# Altium project DC309A.PrjPcb (part 4 of 7)

## Sheet DC309A_FTDI.SchDoc: FTDI
size 558 x 431 mm; Date: Not shown in title block; ApprovedBy: Not shown in title block; CheckedBy: Not shown in title block; Author: Not shown in title block; CompanyName: Not shown in title block; DrawnBy: KAVIKANNAN; Engineer: Not shown in title block; Organization: Not shown in title block; Address1: Not shown in title block; Address2: Not shown in title block; Address3: Not shown in title block; Address4: Not shown in title block; DocumentNumber: 6; Revision: Use project parameter SCH_Rev; SheetNumber: 6; SheetTotal: 11; PageSetup: Record=PageOptions|CenterHorizontal=True|CenterVertical=True|PrintScale=1.00|XCorrection=1.00|YCorrection=1.00|PrintKind=0|BorderSize=5000000|LeftOffset=0|BottomOffset=0|Orientation=2|PaperLength=1000|PaperWidth=1000|Scale=100|PaperSource=15|PrintQuality=600|MediaType=1|DitherType=10|PaperKind=Letter|PrintScaleMode=1; CurrentTime: Not shown in title block; CurrentDate: Not shown in title block; Time: Not shown in title block; DocumentFullPathAndName: Not shown in title block; DocumentName: Not shown in title block; ModifiedDate: Not shown in title block; ImagePath: Not shown in title block
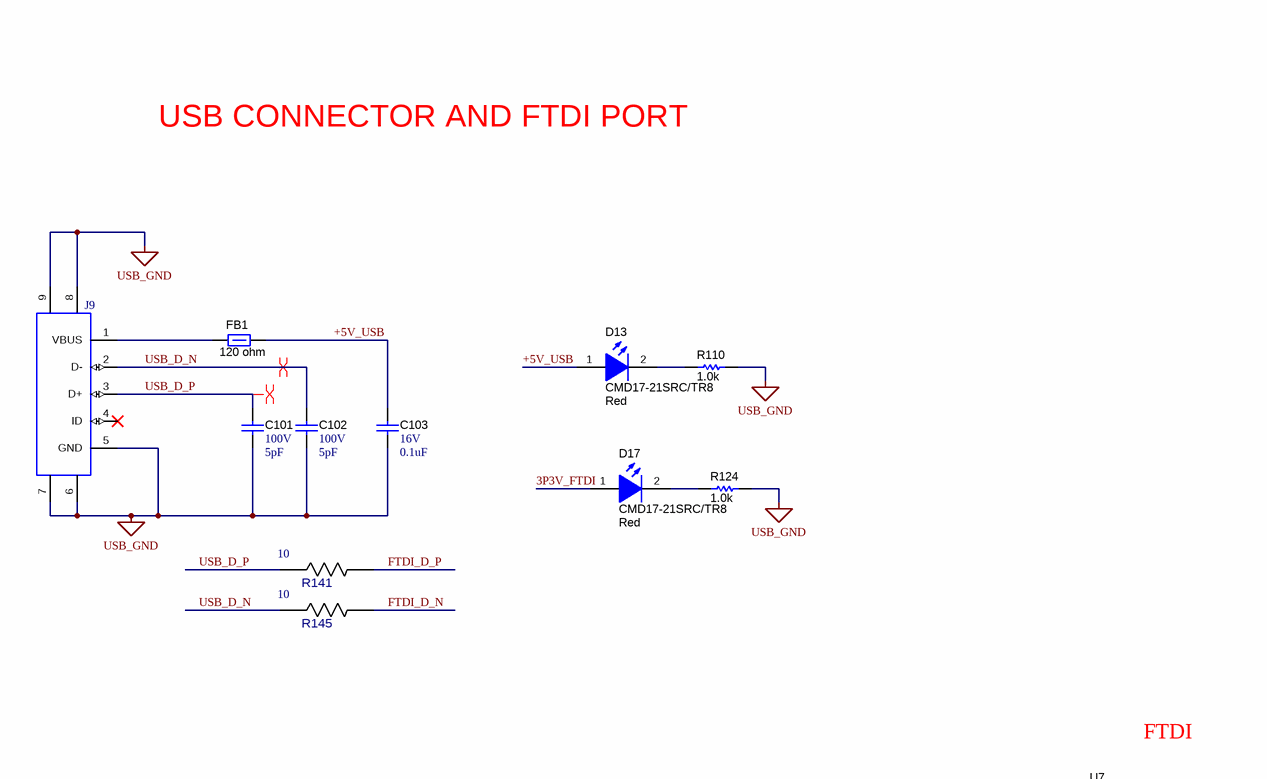
[diagram p16: DC309A_FTDI.SchDoc, top left]
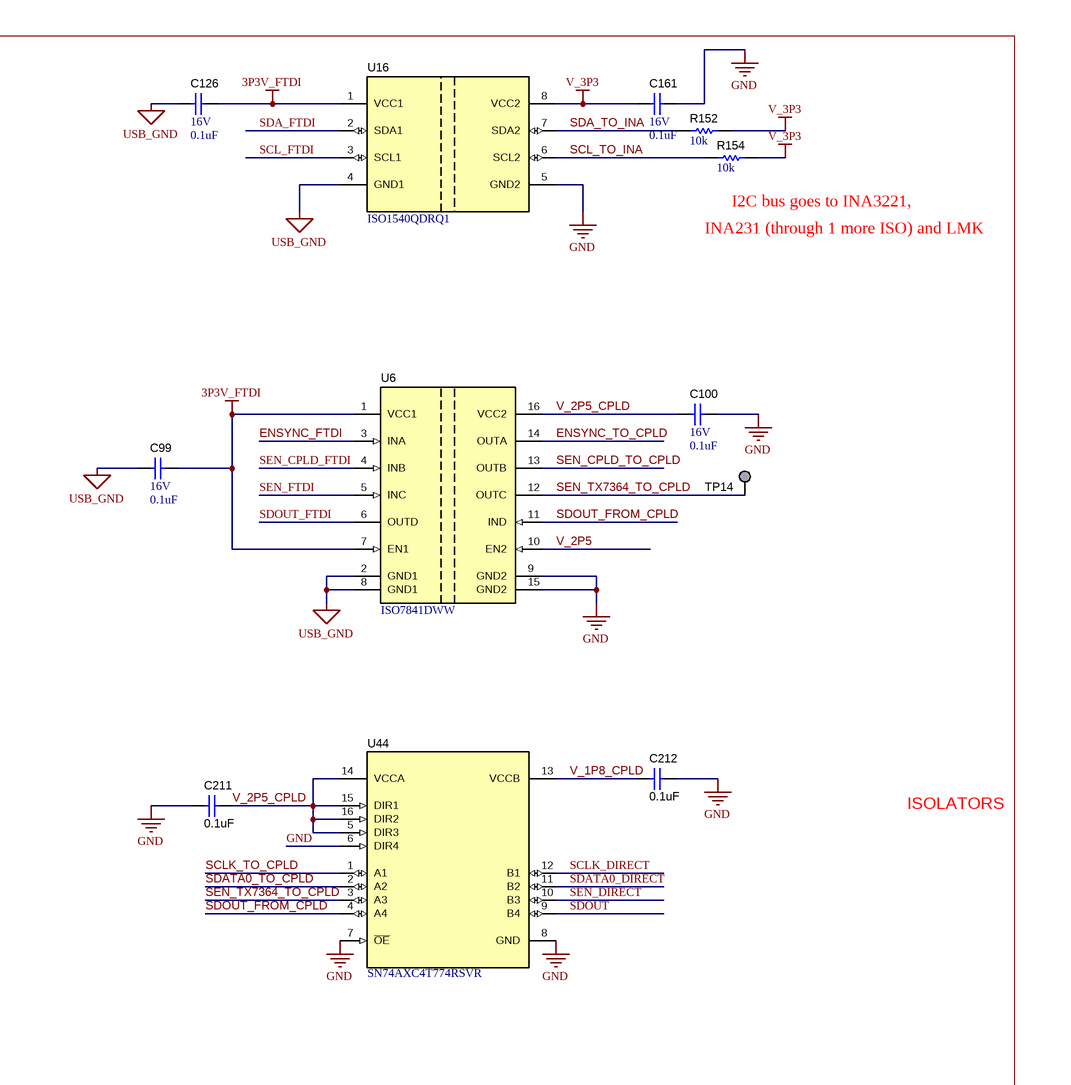
[diagram p17: DC309A_FTDI.SchDoc, top right]
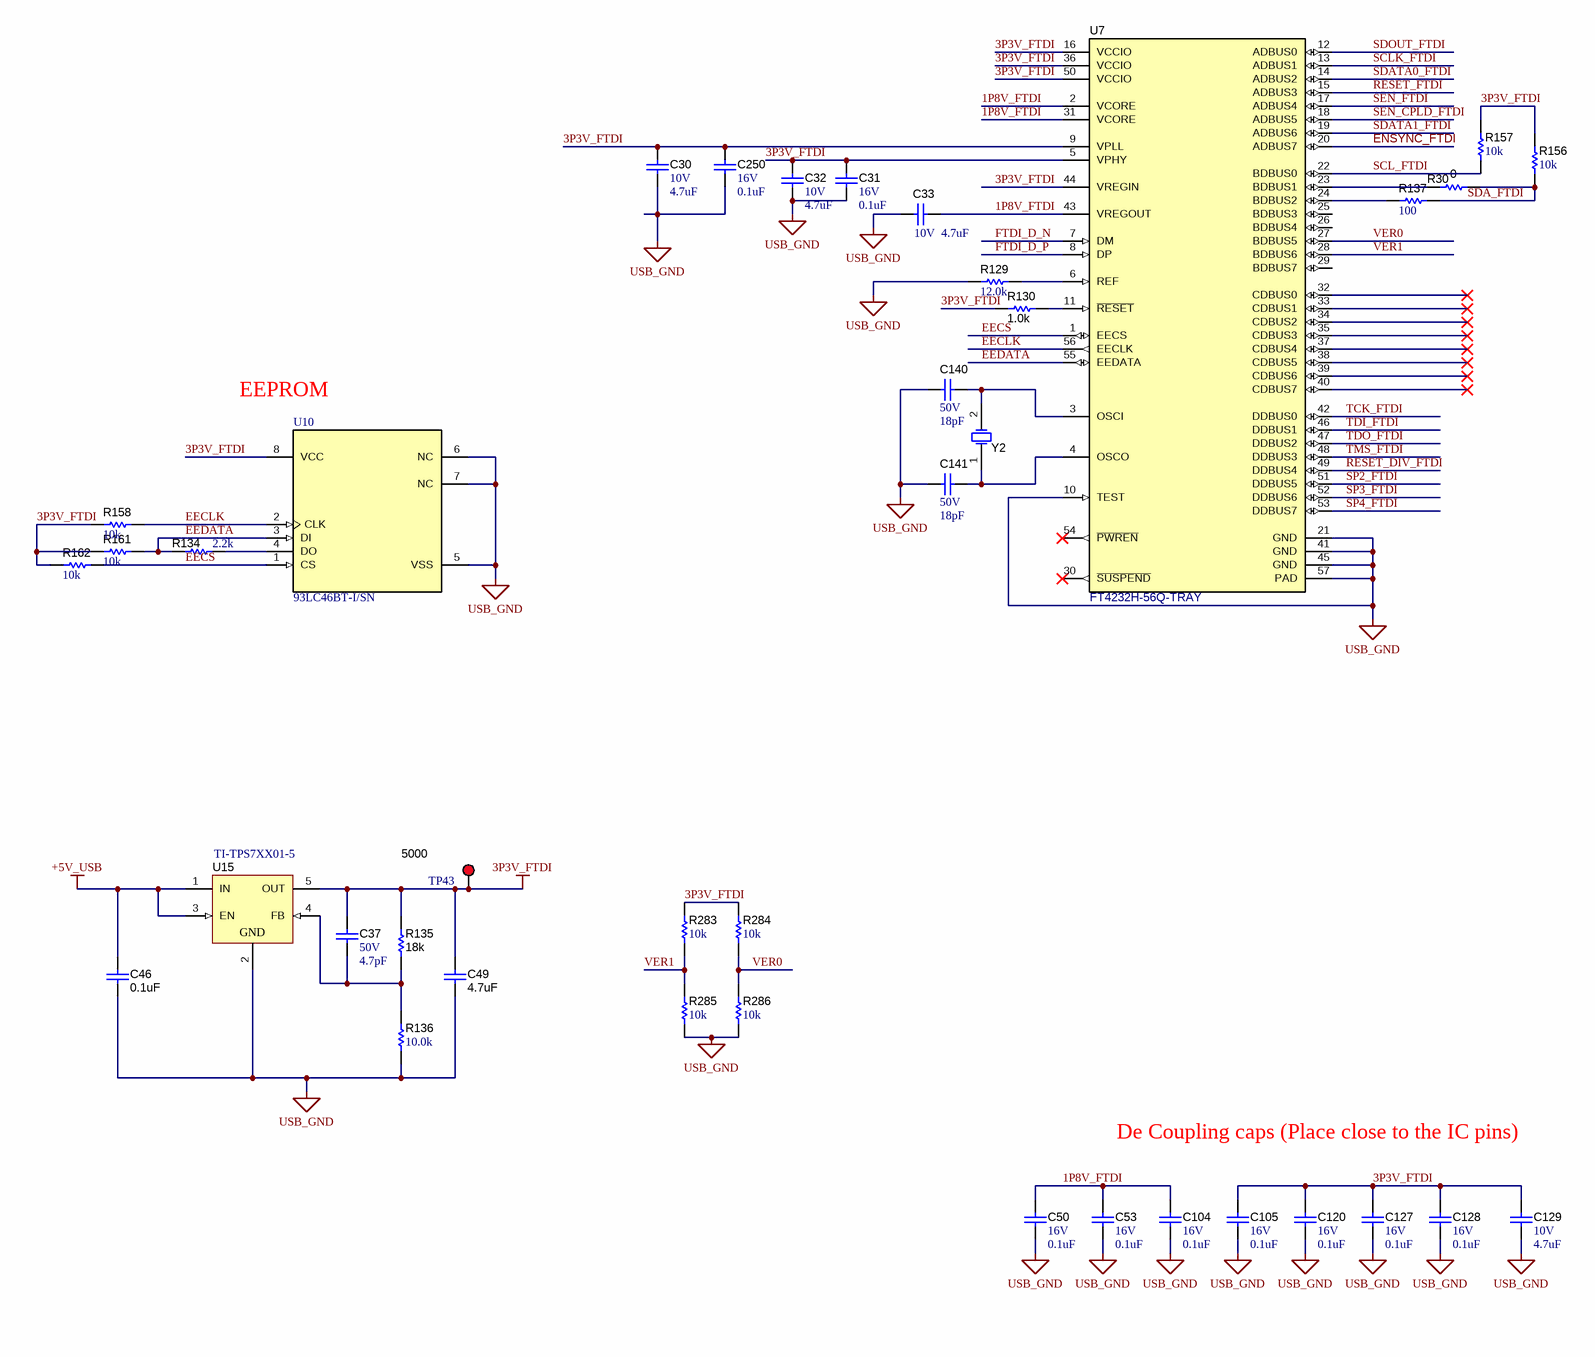
[diagram p18: DC309A_FTDI.SchDoc, bottom left]
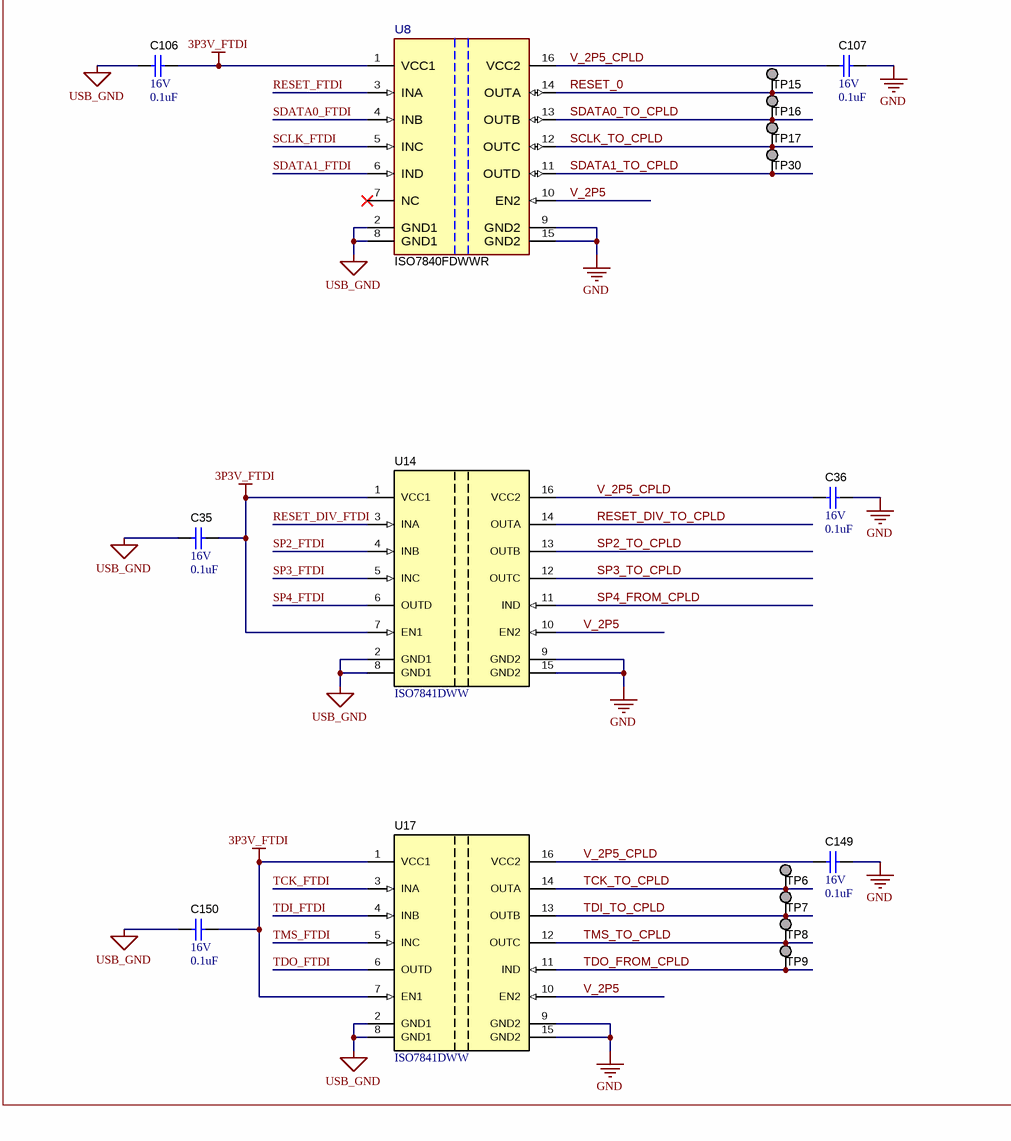
[diagram p19: DC309A_FTDI.SchDoc, bottom right]

### Parts
C30  VDC_V: 10V  ValueDisplayed: 4.7uF  [0402]  (hidden comment: CL05A475MP5NRNC)
C31  VDC_V: 16V  ValueDisplayed: 0.1uF  [0402]  (hidden comment: 0402YC104KAT2A)
C32  VDC_V: 10V  ValueDisplayed: 4.7uF  [0402]  (hidden comment: CL05A475MP5NRNC)
C33  VDC_V: 10V  ValueDisplayed: 4.7uF  [0402]  (hidden comment: CL05A475MP5NRNC)
C35  VDC_V: 16V  ValueDisplayed: 0.1uF  [0402]  (hidden comment: 0402YC104KAT2A)
C36  VDC_V: 16V  ValueDisplayed: 0.1uF  [0402]  (hidden comment: 0402YC104KAT2A)
C37  VDC_V: 50V  ValueDisplayed: 4.7pF  [0603]  (hidden comment: 06035A4R7CAT2A)
C46  ValueDisplayed: 0.1uF  [0402]  (hidden comment: Capacitor)
C49  ValueDisplayed: 4.7uF  [0805_HV]  (hidden comment: Capacitor)
C50  VDC_V: 16V  ValueDisplayed: 0.1uF  [0402]  (hidden comment: 0402YC104KAT2A)
C53  VDC_V: 16V  ValueDisplayed: 0.1uF  [0402]  (hidden comment: 0402YC104KAT2A)
C99  VDC_V: 16V  ValueDisplayed: 0.1uF  [0402]  (hidden comment: 0402YC104KAT2A)
C100  VDC_V: 16V  ValueDisplayed: 0.1uF  [0402]  (hidden comment: 0402YC104KAT2A)
C101  VDC_V: 100V  ValueDisplayed: 5pF  [0402]  (hidden comment: CBR04C509B1GAC)
C102  VDC_V: 100V  ValueDisplayed: 5pF  [0402]  (hidden comment: CBR04C509B1GAC)
C103  VDC_V: 16V  ValueDisplayed: 0.1uF  [0402]  (hidden comment: 0402YC104KAT2A)
C104  VDC_V: 16V  ValueDisplayed: 0.1uF  [0402]  (hidden comment: 0402YC104KAT2A)
C105  VDC_V: 16V  ValueDisplayed: 0.1uF  [0402]  (hidden comment: 0402YC104KAT2A)
C106  VDC_V: 16V  ValueDisplayed: 0.1uF  [0402]  (hidden comment: 0402YC104KAT2A)
C107  VDC_V: 16V  ValueDisplayed: 0.1uF  [0402]  (hidden comment: 0402YC104KAT2A)
C120  VDC_V: 16V  ValueDisplayed: 0.1uF  [0402]  (hidden comment: 0402YC104KAT2A)
C126  VDC_V: 16V  ValueDisplayed: 0.1uF  [0402]  (hidden comment: 0402YC104KAT2A)
C127  VDC_V: 16V  ValueDisplayed: 0.1uF  [0402]  (hidden comment: 0402YC104KAT2A)
C128  VDC_V: 16V  ValueDisplayed: 0.1uF  [0402]  (hidden comment: 0402YC104KAT2A)
C129  VDC_V: 10V  ValueDisplayed: 4.7uF  [0402]  (hidden comment: CL05A475MP5NRNC)
C140  VDC_V: 50V  ValueDisplayed: 18pF  [0603]  (hidden comment: 06035A180JAT2A)
C141  VDC_V: 50V  ValueDisplayed: 18pF  [0603]  (hidden comment: 06035A180JAT2A)
C149  VDC_V: 16V  ValueDisplayed: 0.1uF  [0402]  (hidden comment: 0402YC104KAT2A)
C150  VDC_V: 16V  ValueDisplayed: 0.1uF  [0402]  (hidden comment: 0402YC104KAT2A)
C161  VDC_V: 16V  ValueDisplayed: 0.1uF  [0402]  (hidden comment: 0402YC104KAT2A)
C211  value 0.1uF  [0402]  (hidden comment: Capacitor)
C212  value 0.1uF  [0402]  (hidden comment: Capacitor)
C250  VDC_V: 16V  ValueDisplayed: 0.1uF  [0402]  (hidden comment: 0402YC104KAT2A)
D13  CMD17-21SRC/TR8  value Red  [CMD17-21_Red]
D17  CMD17-21SRC/TR8  value Red  [CMD17-21_Red]
FB1  value 120 ohm  [0603]  (hidden comment: Ferrite_Bead)
J9  CONN_USB_MINI-AB_4Shld  [Molex_67803-8020]  (value not drawn)
R30  value 0  [0402]  (hidden comment: Resistor)
R110  ValueDisplayed: 1.0k  [0402]  (hidden comment: Resistor)
R124  ValueDisplayed: 1.0k  [0402]  (hidden comment: Resistor)
R129  ValueDisplayed: 12.0k  [0402]  (hidden comment: CRCW040212K0FKED)
R130  ValueDisplayed: 1.0k  [0402]  (hidden comment: Resistor)
R134  ValueDisplayed: 2.2k  [0402]  (hidden comment: CRCW04022K20JNED)
R135  ValueDisplayed: 18k  [0402]  (hidden comment: CRCW040218K0JNED)
R136  ValueDisplayed: 10.0k  [0402]  (hidden comment: CRCW040210K0DHEDP)
R137  ValueDisplayed: 100  [0402]  (hidden comment: CRCW0402100RFKED)
R141  Res_ohm: 10  [FP-ERJ-3GEYJ100V_0603-MFG]  (hidden comment: ERJ-3GEYJ100V)
R145  Res_ohm: 10  [FP-ERJ-3GEYJ100V_0603-MFG]  (hidden comment: ERJ-3GEYJ100V)
R152  ValueDisplayed: 10k  [0402]  (hidden comment: ERJ-2GEJ103X)
R154  ValueDisplayed: 10k  [0402]  (hidden comment: ERJ-2GEJ103X)
R156  ValueDisplayed: 10k  [0402]  (hidden comment: ERJ-2GEJ103X)
R157  ValueDisplayed: 10k  [0402]  (hidden comment: ERJ-2GEJ103X)
R158  ValueDisplayed: 10k  [0402]  (hidden comment: ERJ-2GEJ103X)
R161  ValueDisplayed: 10k  [0402]  (hidden comment: ERJ-2GEJ103X)
R162  ValueDisplayed: 10k  [0402]  (hidden comment: ERJ-2GEJ103X)
R283  ValueDisplayed: 10k  [0402]  (hidden comment: ERJ-2GEJ103X)
R284  ValueDisplayed: 10k  [0402]  (hidden comment: ERJ-2GEJ103X)
R285  ValueDisplayed: 10k  [0402]  (hidden comment: ERJ-2GEJ103X)
R286  ValueDisplayed: 10k  [0402]  (hidden comment: ERJ-2GEJ103X)
TP6  (no value)  [TP_50MIL-SMT]  (no BOM)
TP7  (no value)  [TP_50MIL-SMT]  (no BOM)
TP8  (no value)  [TP_50MIL-SMT]  (no BOM)
TP9  (no value)  [TP_50MIL-SMT]  (no BOM)
TP14  (no value)  [TP_50MIL-SMT]  (no BOM)
TP15  (no value)  [TP_50MIL-SMT]  (no BOM)
TP16  (no value)  [TP_50MIL-SMT]  (no BOM)
TP17  (no value)  [TP_50MIL-SMT]  (no BOM)
TP30  (no value)  [TP_50MIL-SMT]  (no BOM)
TP43  5000  [Keystone5000]
U6  ISO7841DWW  [DWW0016A_L]
U7  FT4232H-56Q-TRAY  [VQFN-56]
U8  ISO7840FDWWR  [DWW0016A-MFG]
U10  93LC46BT-I/SN  [SOIC-8]
U14  ISO7841DWW  [DWW0016A_L]
U15  TI-TPS7XX01-5  [DDC0005A_N]
U16  ISO1540QDRQ1  [D0008B_L]
U17  ISO7841DWW  [DWW0016A_L]
U44  SN74AXC4T774RSVR  [RSV0016A]
Y2  ABM3-12.000MHZ-D2Y-T  [XTAL_ABM3]  (value not drawn)

### Nets
3P3V_FTDI: C30.1 C31.1 C32.1 C35.1 C37.1 C49.1 C99.1 C105.1 C106.1 C120.1 C126.1 C127.1 C128.1 C129.1 C150.1 C250.1 D17.1(A) R130.1 R135.2 R156.1 R157.1 R158.1 R161.1 R162.1 R283.1 R284.1 TP43.1 U6.1(VCC1) U6.7(EN1) U7.5(VPHY) U7.9(VPLL) U7.16(VCCIO) U7.36(VCCIO) U7.44(VREGIN) U7.50(VCCIO) U8.1(VCC1) U10.8(VCC) U14.1(VCC1) U14.7(EN1) U15.5(OUT) U16.1(VCC1) U17.1(VCC1) U17.7(EN1)
+5V_USB: C46.1 C103.1 D13.1(A) FB1.2 U15.1(IN) U15.3(EN)
GND: C36.2 C100.2 C107.2 C149.2 C161.2 C211.1 C212.1 U6.9(GND2) U6.15(GND2) U8.9(GND2) U8.15(GND2) U14.9(GND2) U14.15(GND2) U16.5(GND2) U17.9(GND2) U17.15(GND2) U44.6(DIR4) U44.7(~{OE}) U44.8(GND)
USB_GND: C30.2 C31.2 C32.2 C33.1 C35.2 C46.2 C49.2 C50.2 C53.2 C99.2 C101.2 C102.2 C103.2 C104.2 C105.2 C106.2 C120.2 C126.2 C127.2 C128.2 C129.2 C140.2 C141.2 C150.2 C250.2 J9.5(GND) J9.6 J9.7 J9.8 J9.9 R110.2 R124.2 R129.1 R136.1 R285.2 R286.2 U6.2(GND1) U6.8(GND1) U7.10(TEST) U7.21(GND) U7.41(GND) U7.45(GND) U7.57(PAD) U8.2(GND1) U8.8(GND1) U10.5(VSS) U10.6(NC) U10.7(NC) U14.2(GND1) U14.8(GND1) U15.2(GND) U16.4(GND1) U17.2(GND1) U17.8(GND1)
V_2P5: U6.10(EN2) U8.10(EN2) U14.10(EN2) U17.10(EN2)
V_3P3: C161.1 R152.2 R154.2 U16.8(VCC2)
1P8V_FTDI: C33.2 C50.1 C53.1 C104.1 U7.2(VCORE) U7.31(VCORE) U7.43(VREGOUT)
EECLK: R158.2 U7.56(EECLK) U10.2(CLK)
EECS: R162.2 U7.1(EECS) U10.1(CS)
EEDATA: R134.1 R161.2 U7.55(EEDATA) U10.3(DI)
ENSYNC_FTDI: U6.3(INA) U7.20(ADBUS7)
ENSYNC_TO_CPLD: U6.14(OUTA)
FTDI_D_N: R145.2 U7.7(DM)
FTDI_D_P: R141.2 U7.8(DP)
RESET_0: TP15.1 U8.14(OUTA)
RESET_DIV_FTDI: U7.49(DDBUS4) U14.3(INA)
RESET_DIV_TO_CPLD: U14.14(OUTA)
RESET_FTDI: U7.15(ADBUS3) U8.3(INA)
SCL_FTDI: R157.2 U7.22(BDBUS0) U16.3(SCL1)
SCL_TO_INA: R154.1 U16.6(SCL2)
SCLK_DIRECT: U44.12(B1)
SCLK_FTDI: U7.13(ADBUS1) U8.5(INC)
SCLK_TO_CPLD: TP17.1 U8.12(OUTC) U44.1(A1)
SDA_FTDI: R30.2 R137.2 R156.2 U16.2(SDA1)
SDA_TO_INA: R152.1 U16.7(SDA2)
SDATA0_DIRECT: U44.11(B2)
SDATA0_FTDI: U7.14(ADBUS2) U8.4(INB)
SDATA0_TO_CPLD: TP16.1 U8.13(OUTB) U44.2(A2)
SDATA1_FTDI: U7.19(ADBUS6) U8.6(IND)
SDATA1_TO_CPLD: TP30.1 U8.11(OUTD)
SDOUT: U44.9(B4)
SDOUT_FROM_CPLD: U6.11(IND) U44.4(A4)
SDOUT_FTDI: U6.6(OUTD) U7.12(ADBUS0)
SEN_CPLD_FTDI: U6.4(INB) U7.18(ADBUS5)
SEN_CPLD_TO_CPLD: U6.13(OUTB)
SEN_DIRECT: U44.10(B3)
SEN_FTDI: U6.5(INC) U7.17(ADBUS4)
SEN_TX7364_TO_CPLD: TP14.1 U6.12(OUTC) U44.3(A3)
SP2_FTDI: U7.51(DDBUS5) U14.4(INB)
SP2_TO_CPLD: U14.13(OUTB)
SP3_FTDI: U7.52(DDBUS6) U14.5(INC)
SP3_TO_CPLD: U14.12(OUTC)
SP4_FROM_CPLD: U14.11(IND)
SP4_FTDI: U7.53(DDBUS7) U14.6(OUTD)
TCK_FTDI: U7.42(DDBUS0) U17.3(INA)
TCK_TO_CPLD: TP6.1 U17.14(OUTA)
TDI_FTDI: U7.46(DDBUS1) U17.4(INB)
TDI_TO_CPLD: TP7.1 U17.13(OUTB)
TDO_FROM_CPLD: TP9.1 U17.11(IND)
TDO_FTDI: U7.47(DDBUS2) U17.6(OUTD)
TMS_FTDI: U7.48(DDBUS3) U17.5(INC)
TMS_TO_CPLD: TP8.1 U17.12(OUTC)
USB_D_N: C102.1 J9.2(D-) R145.1
USB_D_P: C101.1 J9.3(D+) R141.1
V_1P8_CPLD: C212.2 U44.13(VCCB)
V_2P5_CPLD: C36.1 C100.1 C107.1 C149.1 C211.2 U6.16(VCC2) U8.16(VCC2) U14.16(VCC2) U17.16(VCC2) U44.5(DIR3) U44.14(VCCA) U44.15(DIR1) U44.16(DIR2)
VER0: R284.2 R286.1 U7.27(BDBUS5)
VER1: R283.2 R285.1 U7.28(BDBUS6)
NetC37_2: C37.2 R135.1 R136.2 U15.4(FB)
NetC140_1: C140.1 U7.3(OSCI) Y2.2(OSC2)
NetC141_1: C141.1 U7.4(OSCO) Y2.1(OSC1)
NetD13_2: D13.2(K) R110.1
NetD17_2: D17.2(K) R124.1
NetFB1_1: FB1.1 J9.1(VBUS)
NetR30_1: R30.1 U7.23(BDBUS1)
NetR129_2: R129.2 U7.6(REF)
NetR130_2: R130.2 U7.11(~{RESET})
NetR134_2: R134.2 U10.4(DO)
NetR137_1: R137.1 U7.24(BDBUS2)

Not connected (* = marked no-connect by the designer): J9 4(ID)*; U7 25(BDBUS3) 26(BDBUS4) 29(BDBUS7) 30(~{SUSPEND})* 32(CDBUS0)* 33(CDBUS1)* 34(CDBUS2)* 35(CDBUS3)* 37(CDBUS4)* 38(CDBUS5)* 39(CDBUS6)* 40(CDBUS7)* 54(~{PWREN})*; U8 7(NC)*

### Layout directives
differential pair: USB_D_N, USB_D_P

### Notes on the sheet
- USB CONNECTOR AND FTDI PORT
- (near R154) I2C bus goes to INA3221,
- INA231 (through 1 more ISO) and LMK
- FTDI
- ISOLATORS
- EEPROM
- De Coupling caps (Place close to the IC pins)
- Drawn By:
- SVN Rev:
- Number:
- TID #:
- Orderable:
- Rev:
- Sheet Title:
- File:
- Project Title:
- Designed for:
- Assembly Variant:
- Mod. Date:
- Sheet:
- Size:
- of
- C
- http://www.ti.com
- Texas Instruments and/or its licensors do not warrant the accuracy or completeness of this specification or any information contained therein. Texas Instruments and/or its licensors do not warrant that this design will meet the specifications, will be suitable for your application or fit for any particular purpose, or will operate in an implementation. Texas Instruments and/or its licensors do not warrant that the design is production worthy. You should completely validate and test your design implementation to confirm the system functionality for your application.
- Engineer:
- Contact:
- © Texas Instruments

### Library data of the parts
C30 C32 C33 C129 = CMP-0006342-2: CAP, CERM, 4.7 uF, 10 V, +/- 20%, X5R, 0402; Manufacturer: Samsung Electro-Mechanics; TaMin_C: -55°C; Polarized: N; SizeAreaWB_mm2: 3; Value1: Unknown; U/M: EA; Value: 4.7uF; TaMax_C: 85°C; SizeZ_mm: 0.6; SizeX_mm: 1; SizeY_mm: 0.5; Cap_F: 4.7µF; AEC Category: Q200; Publisher: Texas Instruments; TempCo: X5R; Published: 2008-06-19; RoHS: Y; MountType: SMT; PackageReference: 0402; Tolerance_%: 20%; Cap_Case: 0402; Value2: 10V; SizeArea_mm2: 0.5; CompType: Capacitor; LatestRevisionDate: 2017-03-09; PartNumber: CL05A475MP5NRNC; AEC Qualified: ?; ComponentLink1Description: Datasheet link; Technology: Ceramic; ComponentLink1URL: http://www.samsungsem.com/servlet/FileDownload?type=spec&file=CL05A475MP5NRNC.pdf
C31 C35 C36 C50 C53 C99 C100 C103-C107 C120 C126-C128 C149 C150 C161 C250 = CMP-0006201-2: CAP, CERM, 0.1 uF, 16 V, +/- 10%, X7R, 0402; Manufacturer: AVX; TaMin_C: -55°C; Polarized: N; SizeAreaWB_mm2: 3; Value1: Unknown; U/M: EA; Value: 0.1uF; TaMax_C: 125°C; SizeZ_mm: 0.6; SizeX_mm: 1; SizeY_mm: 0.5; Cap_F: 100nF; AEC Category: Q200; ComponentLink1URL: http://catalogs.avx.com/SurfaceMount.pdf; Supplier Part Number 2: 09R7024; Publisher: Texas Instruments; Supplier 2: Newark; Supplier Part Number 3: 581-0402YC104KAT2A; TempCo: X7R; Supplier 3: Mouser; Published: 2008-06-19; RoHS: Y; MountType: SMT; Supplier 1: Digi-Key; PackageReference: 0402; Tolerance_%: 10%; Cap_Case: 0402; Value2: 16V; SizeArea_mm2: 0.5; CompType: Capacitor; LatestRevisionDate: 2017-03-09; PartNumber: 0402YC104KAT2A; AEC Qualified: N; ComponentLink1Description: Datasheet link; AEC Grade: N/A; Supplier Part Number 1: 478-7888-1-ND; Technology: Ceramic
C37 = CMP-0006791-4: CAP, CERM, 4.7 pF, 50 V, +/- 5%, C0G/NP0, 0603; Manufacturer: AVX; TaMin_C: -55°C; ESR_ohm: 0.633; Polarized: N; SizeAreaWB_mm2: 4.68; Value1: 0.633 ohm; U/M: EA; Value: 4.7pF; TaMax_C: 125°C; SizeZ_mm: 1; SizeX_mm: 1.6; SizeY_mm: 0.8; SizeArea_mm2: 1.28; AEC Category: Q200; Supplier Part Number 2: 581-06035A4R7C; Publisher: Texas Instruments; Supplier 2: Mouser; Supplier Part Number 3: 1833866; TempCo: C0G/NP0; Supplier 3: Farnell; Published: 2008-06-19; RoHS: Y; MountType: SMT; Supplier 1: Digi-Key; PackageReference: 0603; Tolerance_%: 5%; Cap_Case: 0603; Value2: 50V; CompType: Capacitor; LatestRevisionDate: 2017-03-09; PartNumber: 06035A4R7CAT2A; AEC Qualified: N; Cap_F: 4.7pF; ComponentLink1Description: Datasheet link; AEC Grade: N/A; Supplier Part Number 1: 478-1159-1-ND; Technology: Ceramic; ComponentLink1URL: http://datasheets.avx.com/C0GNP0-Dielectric.pdf
C46 = CMP-0006201-2: CAP, CERM, 0.1 uF, 16 V, +/- 10%, X7R, 0402; PartNumber: 0402YC104KAT2A; Manufacturer: AVX; Polarized: N; Value: 0.1uF; U/M: EA; Cap_F: 100nF; Value1: Unknown; VDC_V: 16V; TaMin_C: -55°C; TaMax_C: 125°C; SizeArea_mm2: 0.5; SizeAreaWB_mm2: 3; SizeX_mm: 1; SizeZ_mm: 0.6; AEC Category: Q200; CompType: Capacitor; PackageReference: 0402; RoHS: Y; Tolerance_%: 10%; Value2: 16V; MountType: SMT; Technology: Ceramic; TempCo: X7R; Cap_Case: 0402; SizeY_mm: 0.5; Published: 2008-06-19; Publisher: Texas Instruments; LatestRevisionDate: 2017-03-09; ComponentLink1Description: Datasheet link; ComponentLink1URL: http://catalogs.avx.com/SurfaceMount.pdf; Supplier 1: Digi-Key; Supplier Part Number 1: 478-7888-1-ND; Supplier 2: Newark; Supplier Part Number 2: 09R7024; Supplier 3: Mouser; Supplier Part Number 3: 581-0402YC104KAT2A; AEC Qualified: N; AEC Grade: N/A
C49 = CMP-0007800-2: CAP, CERM, 4.7 uF, 25 V, +/- 10%, X5R, 0805; PartNumber: C0805C475K3PACTU; Manufacturer: Kemet; Polarized: N; Value: 4.7uF; U/M: EA; Cap_F: 4.7µF; Value1: Unknown; VDC_V: 25V; TaMin_C: -55°C; TaMax_C: 85°C; Cap_Case: 0805; SizeArea_mm2: 2.5; SizeAreaWB_mm2: 6.75; SizeX_mm: 2; SizeY_mm: 1.25; SizeZ_mm: 1.45; AEC Category: Q200; CompType: Capacitor; PackageReference: 0805; RoHS: Y; Tolerance_%: 10%; Value2: 25V; MountType: SMT; Technology: Ceramic; TempCo: X5R; Published: 2008-06-19; Publisher: Texas Instruments; LatestRevisionDate: 2017-03-09; ComponentLink1Description: Datasheet link; ComponentLink1URL: http://www.kemet.com/docfinder?Partnumber=C0805C475K3PACTU; Supplier 1: Digi-Key; Supplier Part Number 1: 399-5505-1-ND; Supplier 2: Newark; Supplier Part Number 2: 01N5605; Supplier 3: Mouser; Supplier Part Number 3: 80-C0805C475K3P; AEC Qualified: N; AEC Grade: N/A
C101 C102 = CMP-0860996-1: CAP, CERM, 5 pF, 100 V,+/- 2%, C0G/NP0, 0402; Manufacturer: Kemet; SizeZ_mm: 0.6; SizeX_mm: 1; AEC Category: Q200; U/M: EA; TaMin_C: -55°C; SizeY_mm: 0.5; AEC Qualified: N; TaMax_C: 125°C; SizeAreaWB_mm2: 3; Value: 5pF; Tolerance_%: 2%; TempCo: C0G/NP0; RoHS: Y; Technology: Ceramic; Value2: 100V; ComponentLink1URL: https://content.kemet.com/datasheets/KEM_C1030_CBR_SMD.pdf; Cap_Case: 0402; PackageReference: 0402; SizeArea_mm2: 0.5; AEC Grade: N/A; PartNumber: CBR04C509B1GAC; CompType: Capacitor; Polarized: N; Cap_F: 5pF; MountType: SMT; ComponentLink1Description: Datasheet link
C140 C141 = CMP-0006769-4: CAP, CERM, 18 pF, 50 V, +/- 5%, C0G/NP0, 0603; Manufacturer: AVX; TaMin_C: -55°C; ESR_ohm: 0.289; Polarized: N; SizeAreaWB_mm2: 4.68; Value1: 0.289 ohm; U/M: EA; Value: 18pF; TaMax_C: 125°C; SizeZ_mm: 1; SizeX_mm: 1.6; SizeY_mm: 0.8; SizeArea_mm2: 1.28; AEC Category: Q200; Supplier Part Number 2: 17C6481; Publisher: Texas Instruments; Supplier 2: Newark; Supplier Part Number 3: 581-06035A180J; TempCo: C0G/NP0; Supplier 3: Mouser; Published: 2008-06-19; RoHS: Y; MountType: SMT; Supplier 1: Digi-Key; PackageReference: 0603; Tolerance_%: 5%; Cap_Case: 0603; Value2: 50V; CompType: Capacitor; LatestRevisionDate: 2017-03-09; PartNumber: 06035A180JAT2A; AEC Qualified: N; Cap_F: 18pF; ComponentLink1Description: Datasheet link; AEC Grade: N/A; Supplier Part Number 1: 478-1166-1-ND; Technology: Ceramic; ComponentLink1URL: http://datasheets.avx.com/C0GNP0-Dielectric.pdf
C211 C212 = CMP-0006641-2: CAP, CERM, 0.1 uF, 16 V, +/- 10%, X7R, 0402; PartNumber: GRM155R71C104KA88D; Manufacturer: MuRata; Polarized: N; U/M: EA; Cap_F: 100nF; Value1: Unknown; VDC_V: 16V; TaMin_C: -55°C; TaMax_C: 125°C; AEC Category: Q200; SizeArea_mm2: 0.5; SizeAreaWB_mm2: 3; SizeX_mm: 1; SizeZ_mm: 0.6; CompType: Capacitor; PackageReference: 0402; RoHS: Y; MountType: SMT; ComponentLink1Description: Datasheet link; ComponentLink1URL: http://search.murata.co.jp/Ceramy/PnsearchViewAction.do?HnOFG=ON&HnNFG=ON&SEL_CNT=50&sLang=en&sKey=GRM155R71C104KA88D&x=9&y=9&search=startwith; ValueDisplayed: 0.1uF; Tolerance_%: 10%; Value2: 16V; Technology: Ceramic; TempCo: X7R; Cap_Case: 0402; Published: 2008-06-19; Publisher: Texas Instruments; LatestRevisionDate: 2017-03-09; Supplier 1: Digi-Key; Supplier Part Number 1: 490-3261-1-ND; Supplier 2: Newark; Supplier Part Number 2: 38K1647; Supplier 3: Mouser; Supplier Part Number 3: 81-GRM155R71C104KA88; AEC Qualified: ?; SizeY_mm: 0.5
D13 D17 = CMP-0084855-1: LED, Red, SMD; Manufacturer: Visual Communications Company, LLC; SizeX_mm: 2; SizeArea_mm2: 2.5; SizeAreaWB_mm2: 6.75; Angle: 140; Value2: 1.7V; Ir_A: 100µA; Value1: 0.1W; SizeY_mm: 1.25; Io_A: 20mA; Tjmax_C: 85°C; Power_TotalModule: 100mW; SizeZ_mm: 1.2; Vr_V: 5V; ComponentLink1URL: https://vcclite.com/wp-content/uploads/wpallimport/files/files/CMD1721Seriesver3.pdf; ComponentLink1Description: Datasheet link; PackageReference: 2x1.25mm; Color: Red; PartNumber: CMD17-21SRC/TR8; Vf_V: 1.7V; RoHS: Y; MountType: SMT; Type: ?; CompType: LED
FB1 = CMP-0003352-2: Ferrite Bead, 120 ohm @ 100 MHz, 3 A, 0603; PartNumber: BLM18SG121TN1D; Manufacturer: MuRata; Imax_A: 3A; DCR_ohm: 0.025; Value1: 0.025 ohm; ZTyp@100MHz_Ohm: 120; SizeArea_mm2: 1.28; SizeAreaWB_mm2: 4.68; SizeX_mm: 1.6; SizeY_mm: 0.8; SizeZ_mm: 1; CompType: Ferrite Bead; Value2: 3A; MountType: SMT; PackageReference: 0603; Published: 2014-04-30; Publisher: Texas Instruments; LatestRevisionDate: 2017-03-09; ComponentLink1Description: Datasheet link; ComponentLink1URL: http://search.murata.co.jp/Ceramy/image/img/PDF/ENG/L0110S0100BLM18S.pdf; RoHS: Y; Supplier 1: Digi-Key; Supplier Part Number 1: 490-3996-1-ND; Supplier 2: Newark; Supplier Part Number 2: 73M9122; Supplier 3: Mouser; Supplier Part Number 3: 81-BLM18SG121TN1D; ValueDisplayed: 120 ohm
J9 = CMP-0055303-1: Connector, Receptacle, USB - mini AB, R/A, SMD; PartNumber: 67803-8020; Manufacturer: Molex; CNHeader: FALSE; CT: TRUE; Gender: Female; PackageReference: Receptacle, 5-Leads, Body 9.9x9mm, R/A; CompType: USB; RoHS: Y; MountType: SMT; ComponentLink1Description: Datasheet URL; ComponentLink1URL: http://www.molex.com/pdm_docs/sd/678038020_sd.pdf; Publisher: Texas Instruments; LatestRevisionDate: 26/05/2017; Supplier 1: Digi-Key; Supplier Part Number 1: WM17148CT-ND; Supplier 2: Newark; Supplier Part Number 2: 06X9412; Supplier 3: Mouser; Supplier Part Number 3: 538-67803-8020
R30 = CMP-0026992-3: RES, 0, 5%, 0.1 W, AEC-Q200 Grade 0, 0402; PartNumber: ERJ-2GE0R00X; Manufacturer: Panasonic; Value_Code: 0000; Power_W: 100mW; Value2: 0.1W; VDC_V: 50V; TempCo: 600 ppm/C; SizeArea_mm2: 0.5; SizeX_mm: 1; SizeZ_mm: 0.6; EIA_Code: E24; AEC Category: Q200; AEC Qualified: Y; SizeAreaWB_mm2: 3; CompType: Resistor; PackageReference: 0402; RoHS: Y; Res_ohm: 0; Tolerance_%: 5%; Value1: 5%; MountType: SMT; Technology: Thick Film; SizeY_mm: 0.5; ComponentLink1Description: Datasheet link; ComponentLink1URL: https://industrial.panasonic.com/cdbs/www-data/pdf/RDA0000/AOA0000C301.pdf; Supplier 1: Digi-Key; Supplier Part Number 1: P0.0JCT-ND; Supplier 2: Newark; Supplier Part Number 2: 65T8307; Supplier 3: Mouser; Supplier Part Number 3: 667-ERJ-2GE0R00X; AEC Grade: 0; ValueDisplayed: 0
R110 R124 R130 = CMP-0026852-3: RES, 1.0 k, 5%, 0.063 W, AEC-Q200 Grade 0, 0402; PartNumber: CRCW04021K00JNED; Manufacturer: Vishay-Dale; Value: 1.0k; Res_ohm: 1k; Value_Code: 1k00; Power_W: 63mW; Value2: 0.063W; VDC_V: 50V; TempCo: 200 ppm/C; SizeArea_mm2: 0.5; SizeX_mm: 1; SizeZ_mm: 0.6; EIA_Code: E24; AEC Category: Q200; AEC Qualified: Y; AEC Grade: 0; CompType: Resistor; PackageReference: 0402; RoHS: E; Tolerance_%: 5%; Value1: 5%; MountType: SMT; Technology: Thick Film; SizeY_mm: 0.5; ComponentLink1Description: Datasheet link; ComponentLink1URL: http://www.vishay.com/docs/20035/dcrcwe3.pdf; Supplier 1: Digi-Key; Supplier Part Number 1: 541-1.0KJCT-ND; Supplier 2: Newark; Supplier Part Number 2: 59M6691; Supplier 3: Mouser; Supplier Part Number 3: 71-CRCW0402J-1.0K-E3
R129 = CMP-0025990-3: RES, 12.0 k, 1%, 0.063 W, AEC-Q200 Grade 0, 0402; Manufacturer: Vishay-Dale; Power_W: 63mW; TempCo: 100 ppm/C; Value_Code: 12k0; Value: 12.0k; Res_ohm: 12k; SizeX_mm: 1; SizeY_mm: 0.5; SizeZ_mm: 0.6; Value2: 0.063W; AEC Qualified: Y; VDC_V: 50V; AEC Grade: 0; AEC Category: Q200; Supplier Part Number 2: 52K6646; Supplier 2: Newark; Supplier Part Number 3: 71-CRCW0402-12K-E3; Supplier 3: Mouser; RoHS: E; Value1: 1%; MountType: SMT; Supplier 1: Digi-Key; PackageReference: 0402; Tolerance_%: 1%; SizeArea_mm2: 0.5; CompType: Resistor; PartNumber: CRCW040212K0FKED; ComponentLink1Description: Datasheet link; Supplier Part Number 1: 541-12.0KLCT-ND; Technology: Thick Film; ComponentLink1URL: http://www.vishay.com/docs/20035/dcrcwe3.pdf
R134 = CMP-0026890-5: RES, 2.2 k, 5%, 0.063 W, AEC-Q200 Grade 0, 0402; Manufacturer: Vishay-Dale; Power_W: 63mW; TempCo: 200 ppm/C; Value_Code: 2k20; Value: 2.2k; EIA_Code: E24; SizeX_mm: 1; SizeY_mm: 0.5; SizeZ_mm: 0.6; Value2: 0.063W; AEC Qualified: Y; VDC_V: 50V; AEC Category: Q200; AEC Grade: 0; Supplier Part Number 2: 59M6710; Supplier 2: Newark; Supplier Part Number 3: 71-CRCW0402J-2.2K-E3; Supplier 3: Mouser; RoHS: E; Value1: 5%; MountType: SMT; Supplier 1: Digi-Key; PackageReference: 0402; Tolerance_%: 5%; Res_ohm: 2.2k; SizeArea_mm2: 0.5; CompType: Resistor; PartNumber: CRCW04022K20JNED; ComponentLink1Description: Datasheet link; Supplier Part Number 1: 541-2.2KJCT-ND; Technology: Thick Film; ComponentLink1URL: http://www.vishay.com/docs/20035/dcrcwe3.pdf
R135 = CMP-0026850-3: RES, 18 k, 5%, 0.063 W, AEC-Q200 Grade 0, 0402; Manufacturer: Vishay-Dale; Power_W: 63mW; TempCo: 200 ppm/C; Value_Code: 18k0; Value: 18k; EIA_Code: E24; SizeX_mm: 1; SizeY_mm: 0.5; SizeZ_mm: 0.6; Value2: 0.063W; CompType: Resistor; AEC Qualified: Y; VDC_V: 50V; AEC Category: Q200; AEC Grade: 0; Supplier Part Number 2: 59M6707; Supplier 2: Newark; Supplier Part Number 3: 71-CRCW0402J-18K-E3; Supplier 3: Mouser; RoHS: E; Value1: 5%; MountType: SMT; Supplier 1: Digi-Key; PackageReference: 0402; Tolerance_%: 5%; Res_ohm: 18k; SizeArea_mm2: 0.5; PartNumber: CRCW040218K0JNED; ComponentLink1Description: Datasheet link; Supplier Part Number 1: 541-18KJCT-ND; Technology: Thick Film; ComponentLink1URL: http://www.vishay.com/docs/20035/dcrcwe3.pdf
R136 = CMP-0026769-2: RES, 10.0 k, 0.5%, 0.063 W, AEC-Q200 Grade 0, 0402; Manufacturer: Vishay-Dale; Power_W: 63mW; TempCo: 50 ppm/C; Value_Code: 10k0; Value: 10.0k; EIA_Code: E192; Res_ohm: 10k; SizeX_mm: 1; SizeY_mm: 0.5; SizeZ_mm: 0.6; Value2: 0.063W; AEC Qualified: Y; VDC_V: 50V; AEC Category: Q200; AEC Grade: 0; ComponentLink1URL: http://www.vishay.com/docs/20036/dcrcwpe3.pdf; Supplier Part Number 2: 51X8307; Supplier 2: Newark; Supplier Part Number 3: 71-CRCW040210K0DHEDP; Supplier 3: Mouser; RoHS: E; Value1: 0.5%; MountType: SMT; Supplier 1: Digi-Key; PackageReference: 0402; Tolerance_%: 0.5%; SizeArea_mm2: 0.5; CompType: Resistor; PartNumber: CRCW040210K0DHEDP; ComponentLink1Description: Datasheet link; Supplier Part Number 1: 541-10KAVCT-ND; Technology: Thick Film
R137 = CMP-0025951-3: RES, 100, 1%, 0.063 W, AEC-Q200 Grade 0, 0402; Manufacturer: Vishay-Dale; Power_W: 63mW; TempCo: 100 ppm/C; Value_Code: 100R; Value: 100; EIA_Code: E96; SizeX_mm: 1; SizeY_mm: 0.5; SizeZ_mm: 0.6; Value2: 0.063W; AEC Qualified: Y; VDC_V: 50V; AEC Category: Q200; AEC Grade: 0; Supplier Part Number 2: 52K6609; Supplier 2: Newark; Supplier Part Number 3: 71-CRCW0402-100-E3; Supplier 3: Mouser; RoHS: E; Value1: 1%; MountType: SMT; Supplier 1: Digi-Key; PackageReference: 0402; Tolerance_%: 1%; Res_ohm: 100; SizeArea_mm2: 0.5; CompType: Resistor; PartNumber: CRCW0402100RFKED; ComponentLink1Description: Datasheet link; Supplier Part Number 1: 541-100LCT-ND; Technology: Thick Film; ComponentLink1URL: http://www.vishay.com/docs/20035/dcrcwe3.pdf
R141 R145 = CMP-0087528-1: Thick Film Resistors - SMD 0603 10ohms 5% AEC-Q200; Manufacturer: Panasonic; VDC_V: 75V; AEC Qualified: Yes; TempCo: 200ppm/°C; SizeZ_mm: 0.55mm; AEC Grade: Grade 0; Power_W: 100mW; Symbol Name: SYM-ERJ-3GEYJ100V; ComponentLink1Description: Datasheet; ComponentLink1URL: https://industrial.panasonic.com/cdbs/www-data/pdf/RDA0000/AOA0000C301.pdf; PackageReference: 0603; PartNumber: ERJ-3GEYJ100V; RoHS: TRUE; Technology: Thick Film; Tolerance_%: 5%
R152 R154 R156-R158 R161 R162 R283-R286 = CMP-0026994-4: RES, 10 k, 5%, 0.1 W, AEC-Q200 Grade 0, 0402; Manufacturer: Panasonic; Power_W: 100mW; TempCo: 200 ppm/C; Value_Code: 10k0; U/M: EA; Value: 10k; EIA_Code: E24; SizeX_mm: 1; SizeY_mm: 0.5; SizeZ_mm: 0.6; Value2: 0.1W; AEC Qualified: Y; VDC_V: 50V; AEC Grade: 0; AEC Category: Q200; ComponentLink1URL: http://industrial.panasonic.com/lecs/www-data/pdf/AOA0000/AOA0000CE2.pdf; Supplier Part Number 2: 65T8248; Publisher: Texas Instruments; Supplier 2: Newark; Supplier Part Number 3: 667-ERJ-2GEJ103X; Supplier 3: Mouser; Published: 2008-06-26; RoHS: Y; Value1: 5%; MountType: SMT; Supplier 1: Digi-Key; PackageReference: 0402; Tolerance_%: 5%; Res_ohm: 10k; SizeArea_mm2: 0.5; CompType: Resistor; LatestRevisionDate: 2017-03-09; PartNumber: ERJ-2GEJ103X; ComponentLink1Description: Datasheet link; Supplier Part Number 1: P10KJCT-ND; Technology: Thick Film
TP6-TP9 TP14-TP17 TP30 = CMP-0078143-3: TEST POINT.  No entry in BOM.; PackageReference: N/A; CompType: Testpoint; Manufacturer: N/A; PartNumber: N/A; Library Reference: TESTPOINT
TP43 = CMP-0055137-2: Test Point, Miniature, Red, TH; Manufacturer: Keystone Electronics; ContactFinish: Silver; CNHeader: FALSE; CT: TRUE; Green_Lifecycle: Active; Green_REACh: Passed; PartNumber: 5000; PackageReference: Red Miniature Testpoint; CompType: Test Point; RoHS: Y; MountType: TH; ComponentLink1Description: Datasheet URL; ComponentLink1URL: http://www.keyelco.com/userAssets/file/M60-2p60.pdf; Color: Red; Publisher: Texas Instruments; LatestRevisionDate: 26/05/2017; Supplier 1: Digi-Key; Supplier Part Number 1: 36-5000-ND; Supplier 2: Mouser; Supplier Part Number 2: 534-5000; Green_EU RoHS-2: Incomplete; Green_EU RoHS: Passed
U6 U14 U17 = CMP-0076076-2: High-Immunity, 5.7kVRMS Reinforced Quad-Channel 3/1 Digital Isolator, 100Mbps, DWW0016A (SOIC-16); Manufacturer: Texas Instruments; Alternate PartNumber: ISO7841DWWR; SizeAreaWB_mm2: 244.155; SizeArea_mm2: 183.855; SizeZ_mm: 2.65; SizeY_mm: 10.3; CompType: IC; SizeX_mm: 17.85; AEC Category: Q200; AEC Qualified: N; Rating: Catalog; ComponentLink1Description: Datasheet Link; RoHS: Y; PackageReference: DWW0016A; PartNumber: ISO7841DWW; PackageDescription: SOIC-16; Alternate Manufacturer: Texas Instruments; ComponentLink1URL: http://www.ti.com/lit/ds/symlink/iso7841.pdf; MountType: SMT; ComponentLink2Description: Product Folder; ComponentLink2URL: http://www.ti.com/product/iso7841; ComponentLink3Description: Online Datasheet; ComponentLink3URL: http://www.ti.com/product/iso7841/datasheet; Operating Temperature Range: -55 to 125 C
U7 = CMP-0081661-1: Future Technology Devices International Ltd FT4232H Quad High Speed USB to Multipurpose UART/MPSSE IC, VQFN-56; Manufacturer: FTDI; SizeZ_mm: 1; SizeX_mm: 8; SizeArea_mm2: 64; SizeAreaWB_mm2: 100; ComponentLink1URL: http://www.ftdichip.com/Support/Documents/DataSheets/ICs/DS_FT4232H.pdf; SizeY_mm: 8; Supplier Part Number 2: 895-FT4232H-56Q-TRAY; Supplier 1: Digi-Key; PackageReference: VQFN-56; RoHS: Y; Supplier Part Number 1: 768-1277-ND; PartNumber: FT4232H-56Q-TRAY; MountType: SMT; ComponentLink1Description: Datasheet URL; Supplier 2: Mouser
U8 = CMP-0096150-1: High-Performance, 8000-VPK Reinforced Quad-Channel Digital Isolator; Manufacturer: Texas Instruments; Interface: LVCMOS; AEC Qualified: No; TaMax_C: +125°C; Max Supply Voltage: 5.5V; TJmax_C: +150°C; TaMin_C: -55°C; Standoff Height: 0.1mm; SizeZ_mm: 2.65mm; Min Supply Voltage: 2.25V; PackageReference: SOIC16; PartNumber: ISO7840FDWWR; Part Number: ISO7840FDWWR; helpURL: https://upverter.com/upn/revision/f8abed5a6926f19d/; Lead Free: Yes; RoHS: TRUE; Digikey Part Number: 296-45223-1-ND; ComponentLink1URL: https://www.ti.com/lit/ds/symlink/iso7840.pdf; Mouser Part Number: 595-ISO7840FDWWR; Digikey Description: DGTL ISO 5700VRMS 4CH GP 16SOIC; ComponentLink1Description: Datasheet; datasheet: https://www.ti.com/lit/ds/symlink/iso7840.pdf; Datasheet Path: datasheets/IC-ISO7840FDWWR.pdf; Operating Temperature Range: -55°C to +125°C
U10 = CMP-0005249-2: 1K Microwire Compatible Serial EEPROM; Manufacturer: Microchip; SizeAreaWB_mm2: 55.131; SizeZ_mm: 1.75; SizeX_mm: 5.99; SizeY_mm: 4.9; SizeArea_mm2: 29.351; Supplier Part Number 2: 75M3690; Publisher: Texas Instruments; Supplier 2: Newark; Supplier Part Number 3: 579-93LC46BT-I/SN; Supplier 3: Mouser; RoHS: Y; MountType: SMT; Supplier 1: Digi-Key; PackageReference: SOIC-8; LatestRevisionDate: 09/03/2017; PartNumber: 93LC46BT-I/SN; ComponentLink1Description: Datasheet URL; Supplier Part Number 1: 93LC46BT-I/SNCT-ND; ComponentLink1URL: http://ww1.microchip.com/downloads/en/DeviceDoc/20001749K.pdf
U15 = CMP-0035863-1: Single Output High PSRR LDO, 200 mA, Adjustable 1.2 to 6.5 V Output, 2.7 to 6.5 V Input, with Low IQ, 5-pin SOT (DDC), -40 to 85 degC, Green (RoHS & no Sb/Br); Manufacturer: Texas Instruments; PartNumber: TPS79901DDCR; Accuracy(%): 2; Iout(Max)(A): 0.2; Iq(Typ)(mA): 0.04; Rating: Catalog; SubFamily: Single Channel LDO; Vdo(Typ)(mV): 90; Vin(Max)(V): 6.5; Vin(Min)(V): 2.7; Vout Adj(Min)(V): 1.2; DatasheetVersion: SBVS056J; PackageVersion: 4204403-2/E; PackageReference: DDC0005A; PackageDescription: 5-Pin Plastic Small Outline, Body 2.9 x 1.6 mm, 0.95 mm Pitch; Eco-Plan: Green (RoHS & no Sb/Br); Vout Adj(Max)(V): 6.5; Code_JEDEC: MO-193; ComponentLink1Description: Manufacturer URL; ComponentLink1URL: http://www.ti.com/; ComponentLink2Description: Datasheet; ComponentLink2URL: http://www.ti.com/general/docs/lit/getliterature.tsp?genericPartNumber=TPS79901&fileType=pdf; ComponentLink3Description: Package Specification; ComponentLink3URL: http://www.ti.com/litv/pdf/mpds123d; ComponentLink4Description: URL Link1; ComponentLink4URL: Samples URL:http://www.ti.com/product/tps79901#samples; Mounting Technology: Surface Mount
U16 = CMP-0076084-2: Low-Power Bidirectional I2C Isolators, D0008B (SOIC-8); Manufacturer: Texas Instruments; Alternate PartNumber: ISO1540QDQ1; AEC Qualified: Y; SizeY_mm: 4.9; SizeX_mm: 6.0; AEC Category: Q200; SizeZ_mm: 1.75; CompType: IC; SizeAreaWB_mm2: 55.2; Rating: Automotive; SizeArea_mm2: 29.4; PackageReference: D0008B; ComponentLink3URL: http://www.ti.com/product/iso1540-q1/datasheet; ComponentLink3Description: Online Datasheet; Alternate Manufacturer: Texas Instruments; Operating Temperature Range: -40 to 125 C; ComponentLink1URL: http://www.ti.com/lit/ds/symlink/iso1540-q1.pdf; RoHS: Y; MountType: SMT; PartNumber: ISO1540QDRQ1; ComponentLink2URL: http://www.ti.com/product/iso1540-q1; PackageDescription: SOIC-8; ComponentLink1Description: Datasheet Link; ComponentLink2Description: Product Folder
U44 = CMP-0084716-1: 4 Bit Direction Controlled Level Translator, RSV0016A (UQFN-16); Manufacturer: Texas Instruments; SizeAreaWB_mm2: 10.08; SizeY_mm: 2.6; SizeArea_mm2: 4.68; CompType: IC; SizeZ_mm: 0.55; AEC Category: Q200; SizeX_mm: 1.8; AEC Qualified: N; PackageReference: RSV0016A; PartNumber: SN74AXC4T774RSVR; ComponentLink3Description: Online Datasheet; PackageDescription: UQFN-16; ComponentLink3URL: http://www.ti.com/product/sn74axc4t774/datasheet; MountType: SMT; ComponentLink1Description: Datasheet Link; ComponentLink2Description: Product Folder; ComponentLink1URL: http://www.ti.com/lit/ds/symlink/sn74axc4t774.pdf; Alternate Manufacturer: Texas Instruments; ComponentLink2URL: http://www.ti.com/product/sn74axc4t774
Y2 = CMP-0004616-3: Crystal, 12 MHz, 18 pF, SMD; Manufacturer: Abracon Corporation; TaMin_C: -40°C; Frequency Stability: +/-30ppm; Frequency_Fixed: 12MHz; TaMax_C: 85°C; Supplier Part Number 2: 76R7517; Supplier 2: Newark; Supplier Part Number 3: 815-ABM3-12-D2Y-T; Supplier 3: Mouser; RoHS: E; MountType: SMT; Supplier 1: Digi-Key; PackageReference: ABM3; CompType: Crystal; PartNumber: ABM3-12.000MHZ-D2Y-T; ComponentLink1Description: Datasheet Link; Supplier Part Number 1: 535-10634-1-ND; ComponentLink1URL: http://www.abracon.com/Resonators/abm3.pdf; REACh: Y